# Altium schematic sheet AM625SIP FatBoi.SchDoc (part 1 of 2)
size A0; SheetNumber: 1; SheetTotal: 1
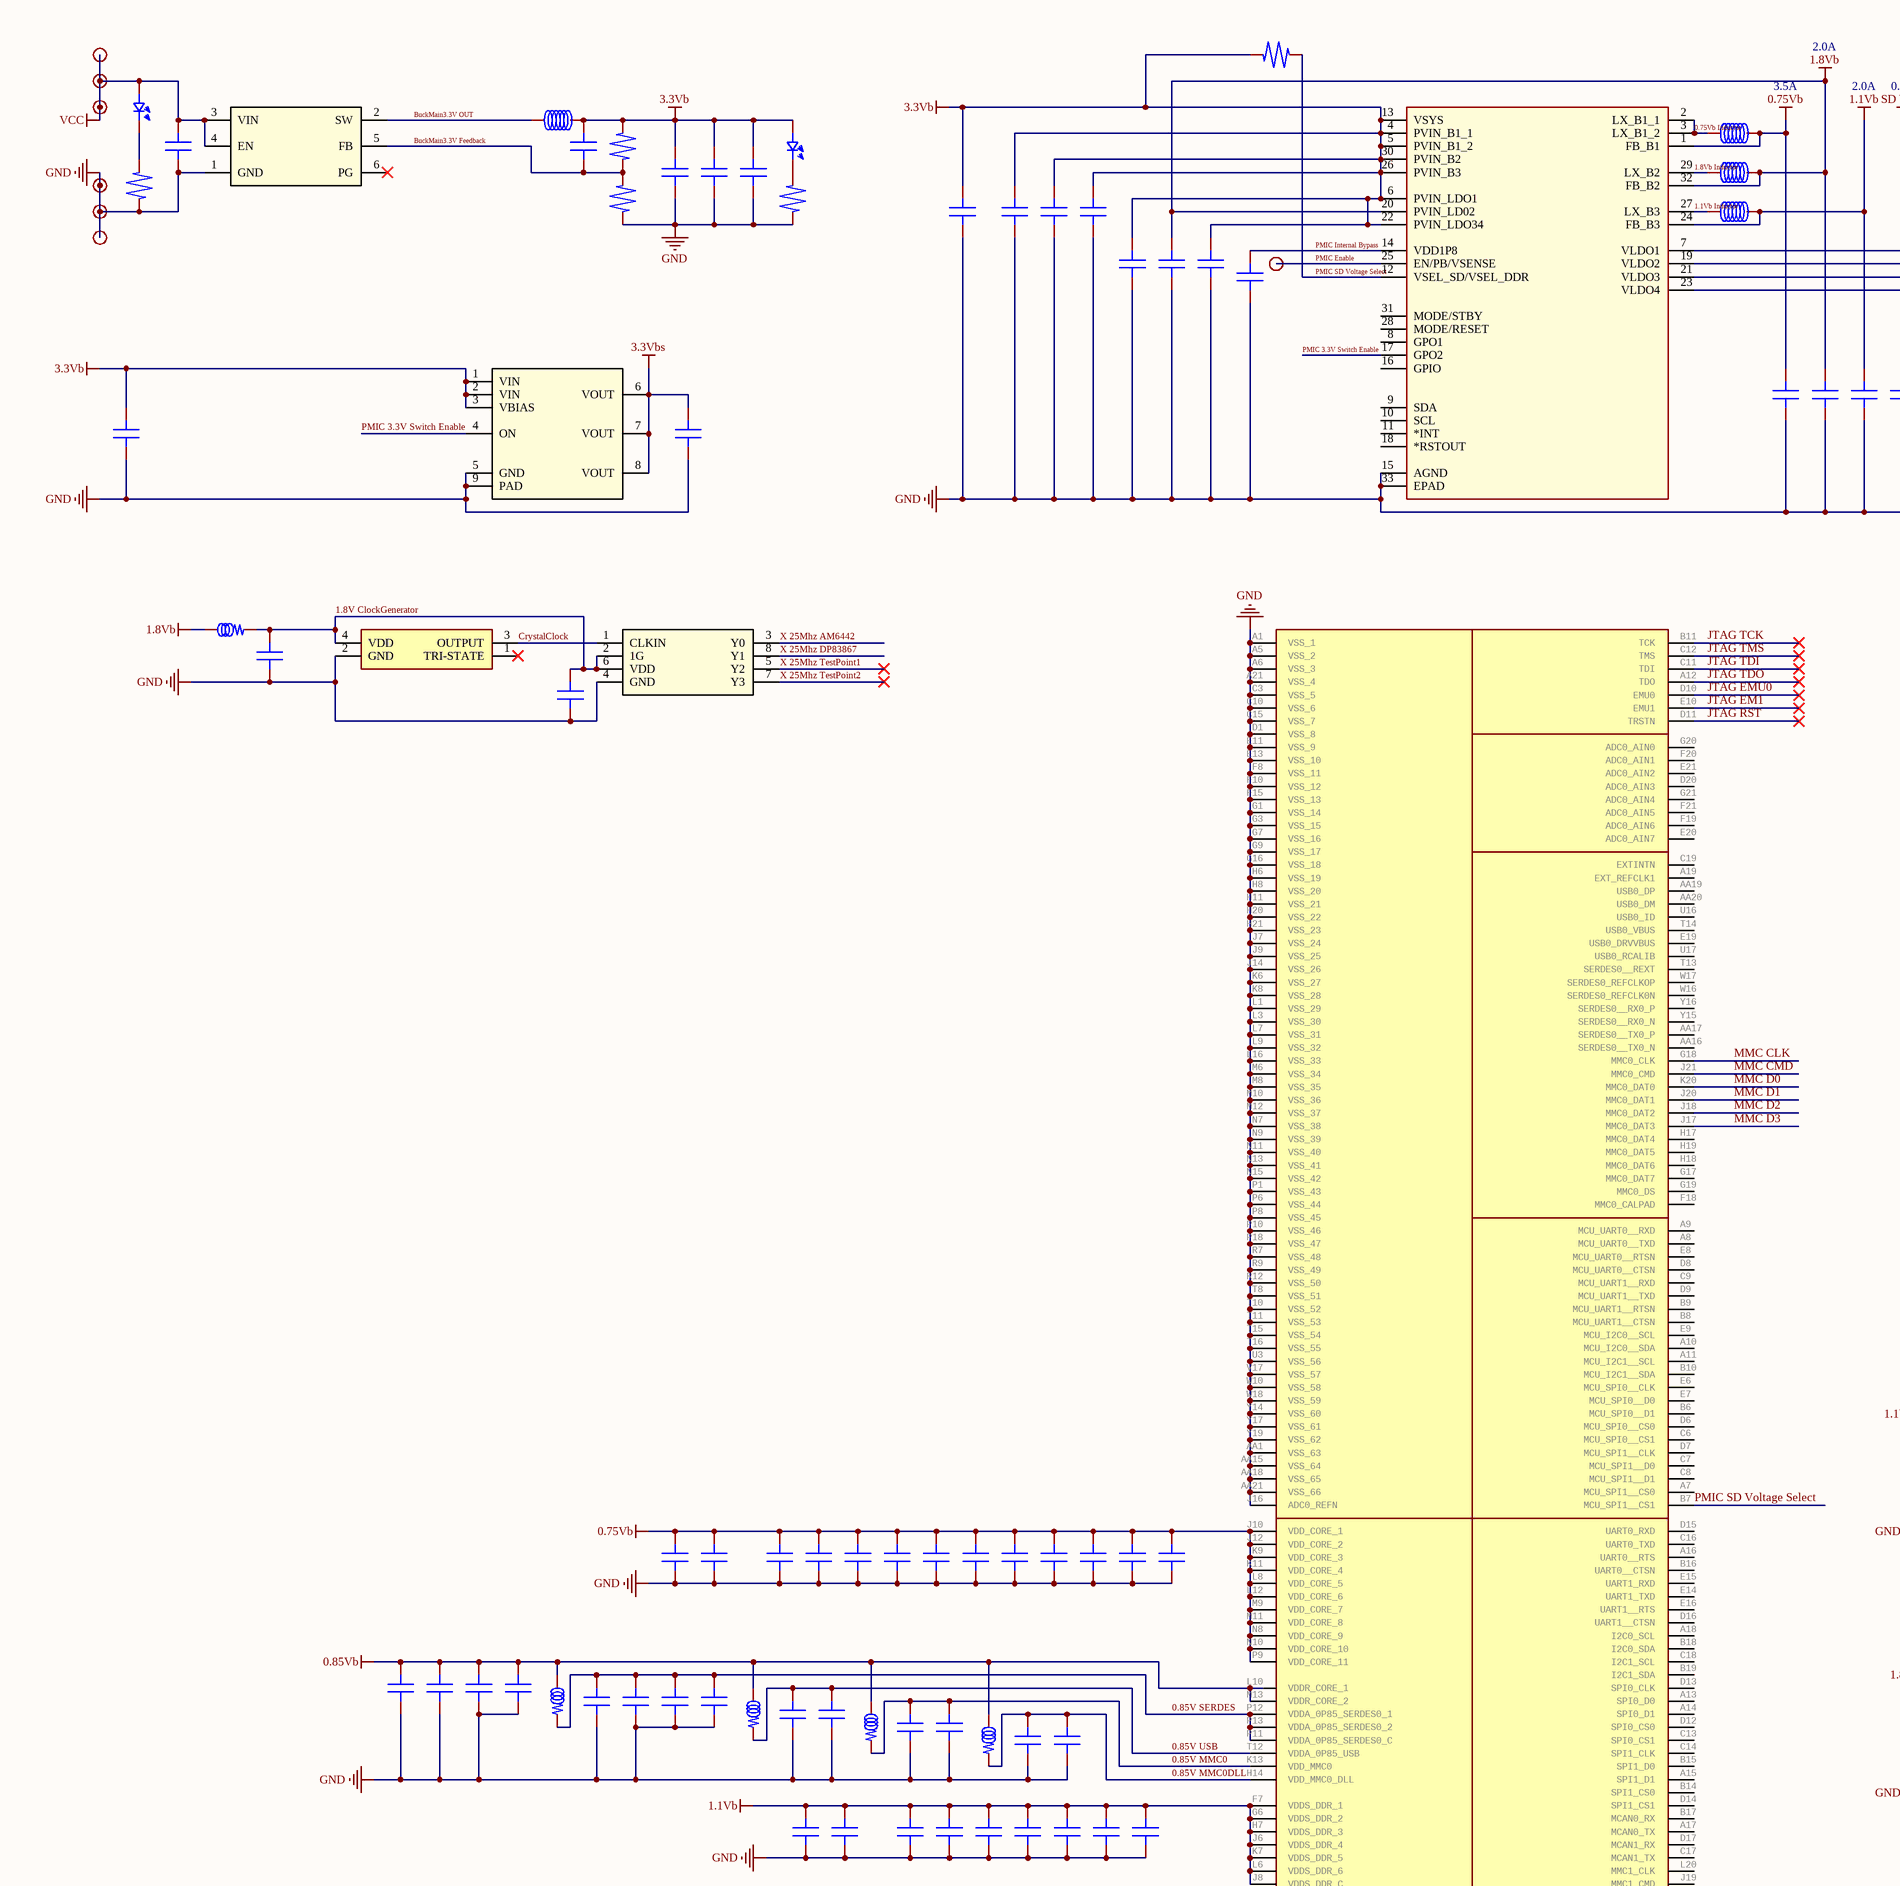
[diagram p0: AM625SIP FatBoi.SchDoc, top left]
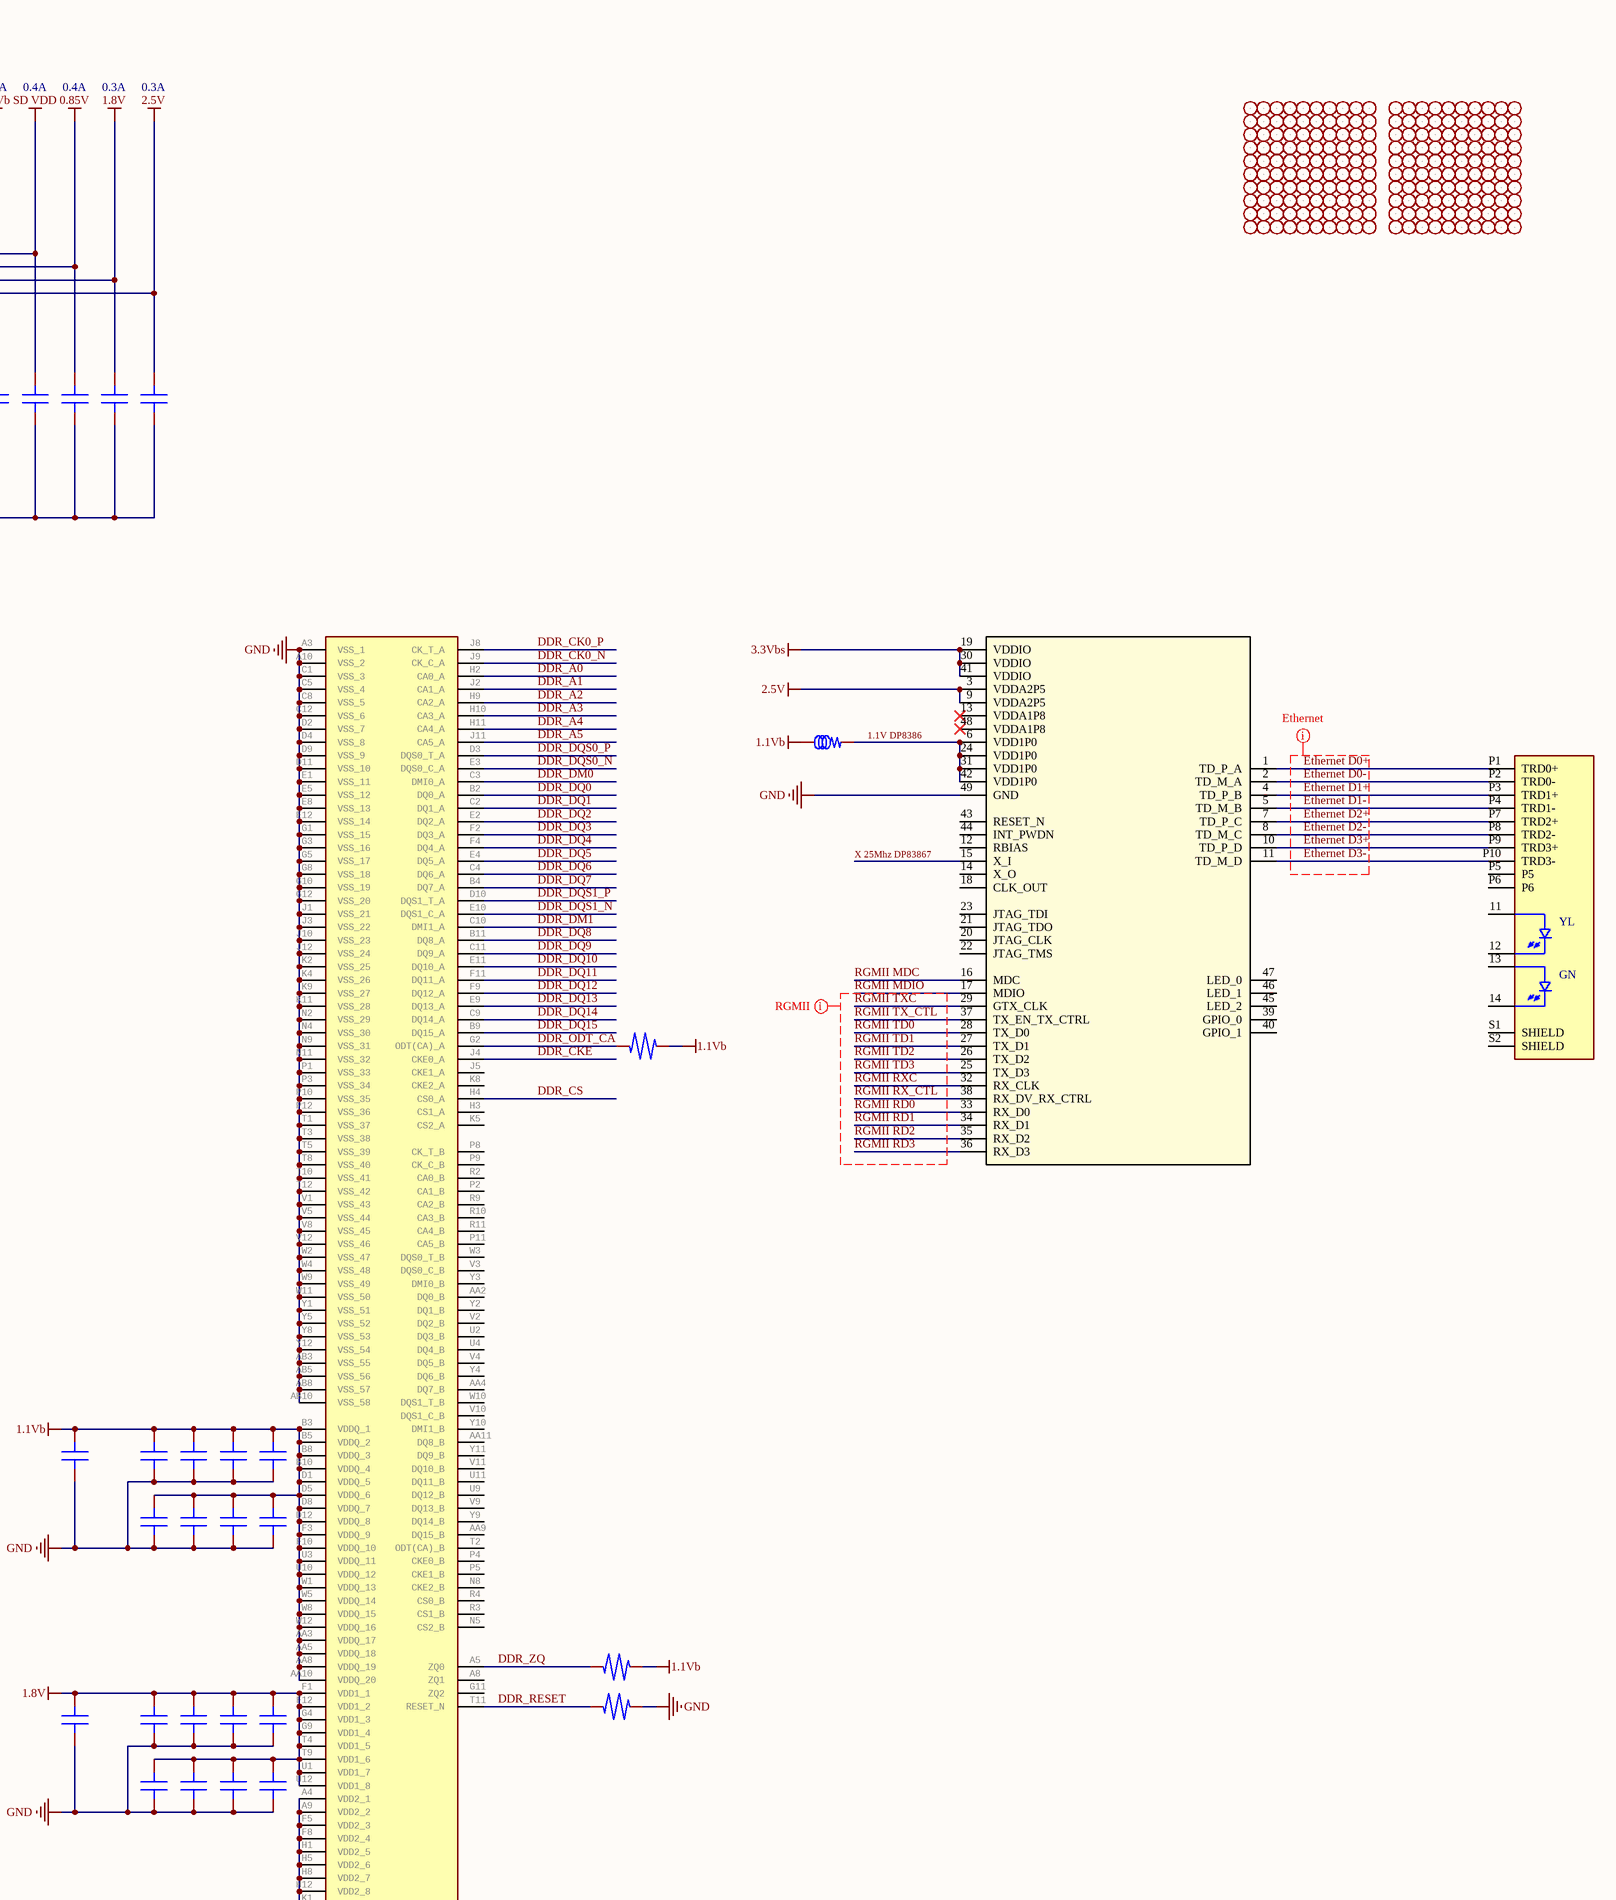
[diagram p1: AM625SIP FatBoi.SchDoc, top middle]
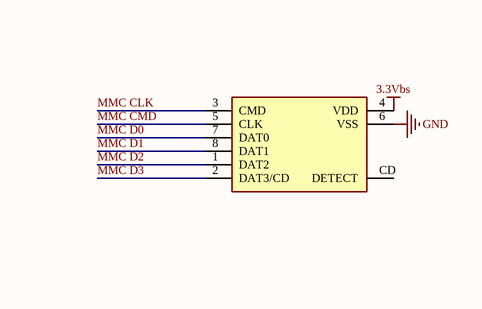
[diagram p2: AM625SIP FatBoi.SchDoc, top right]
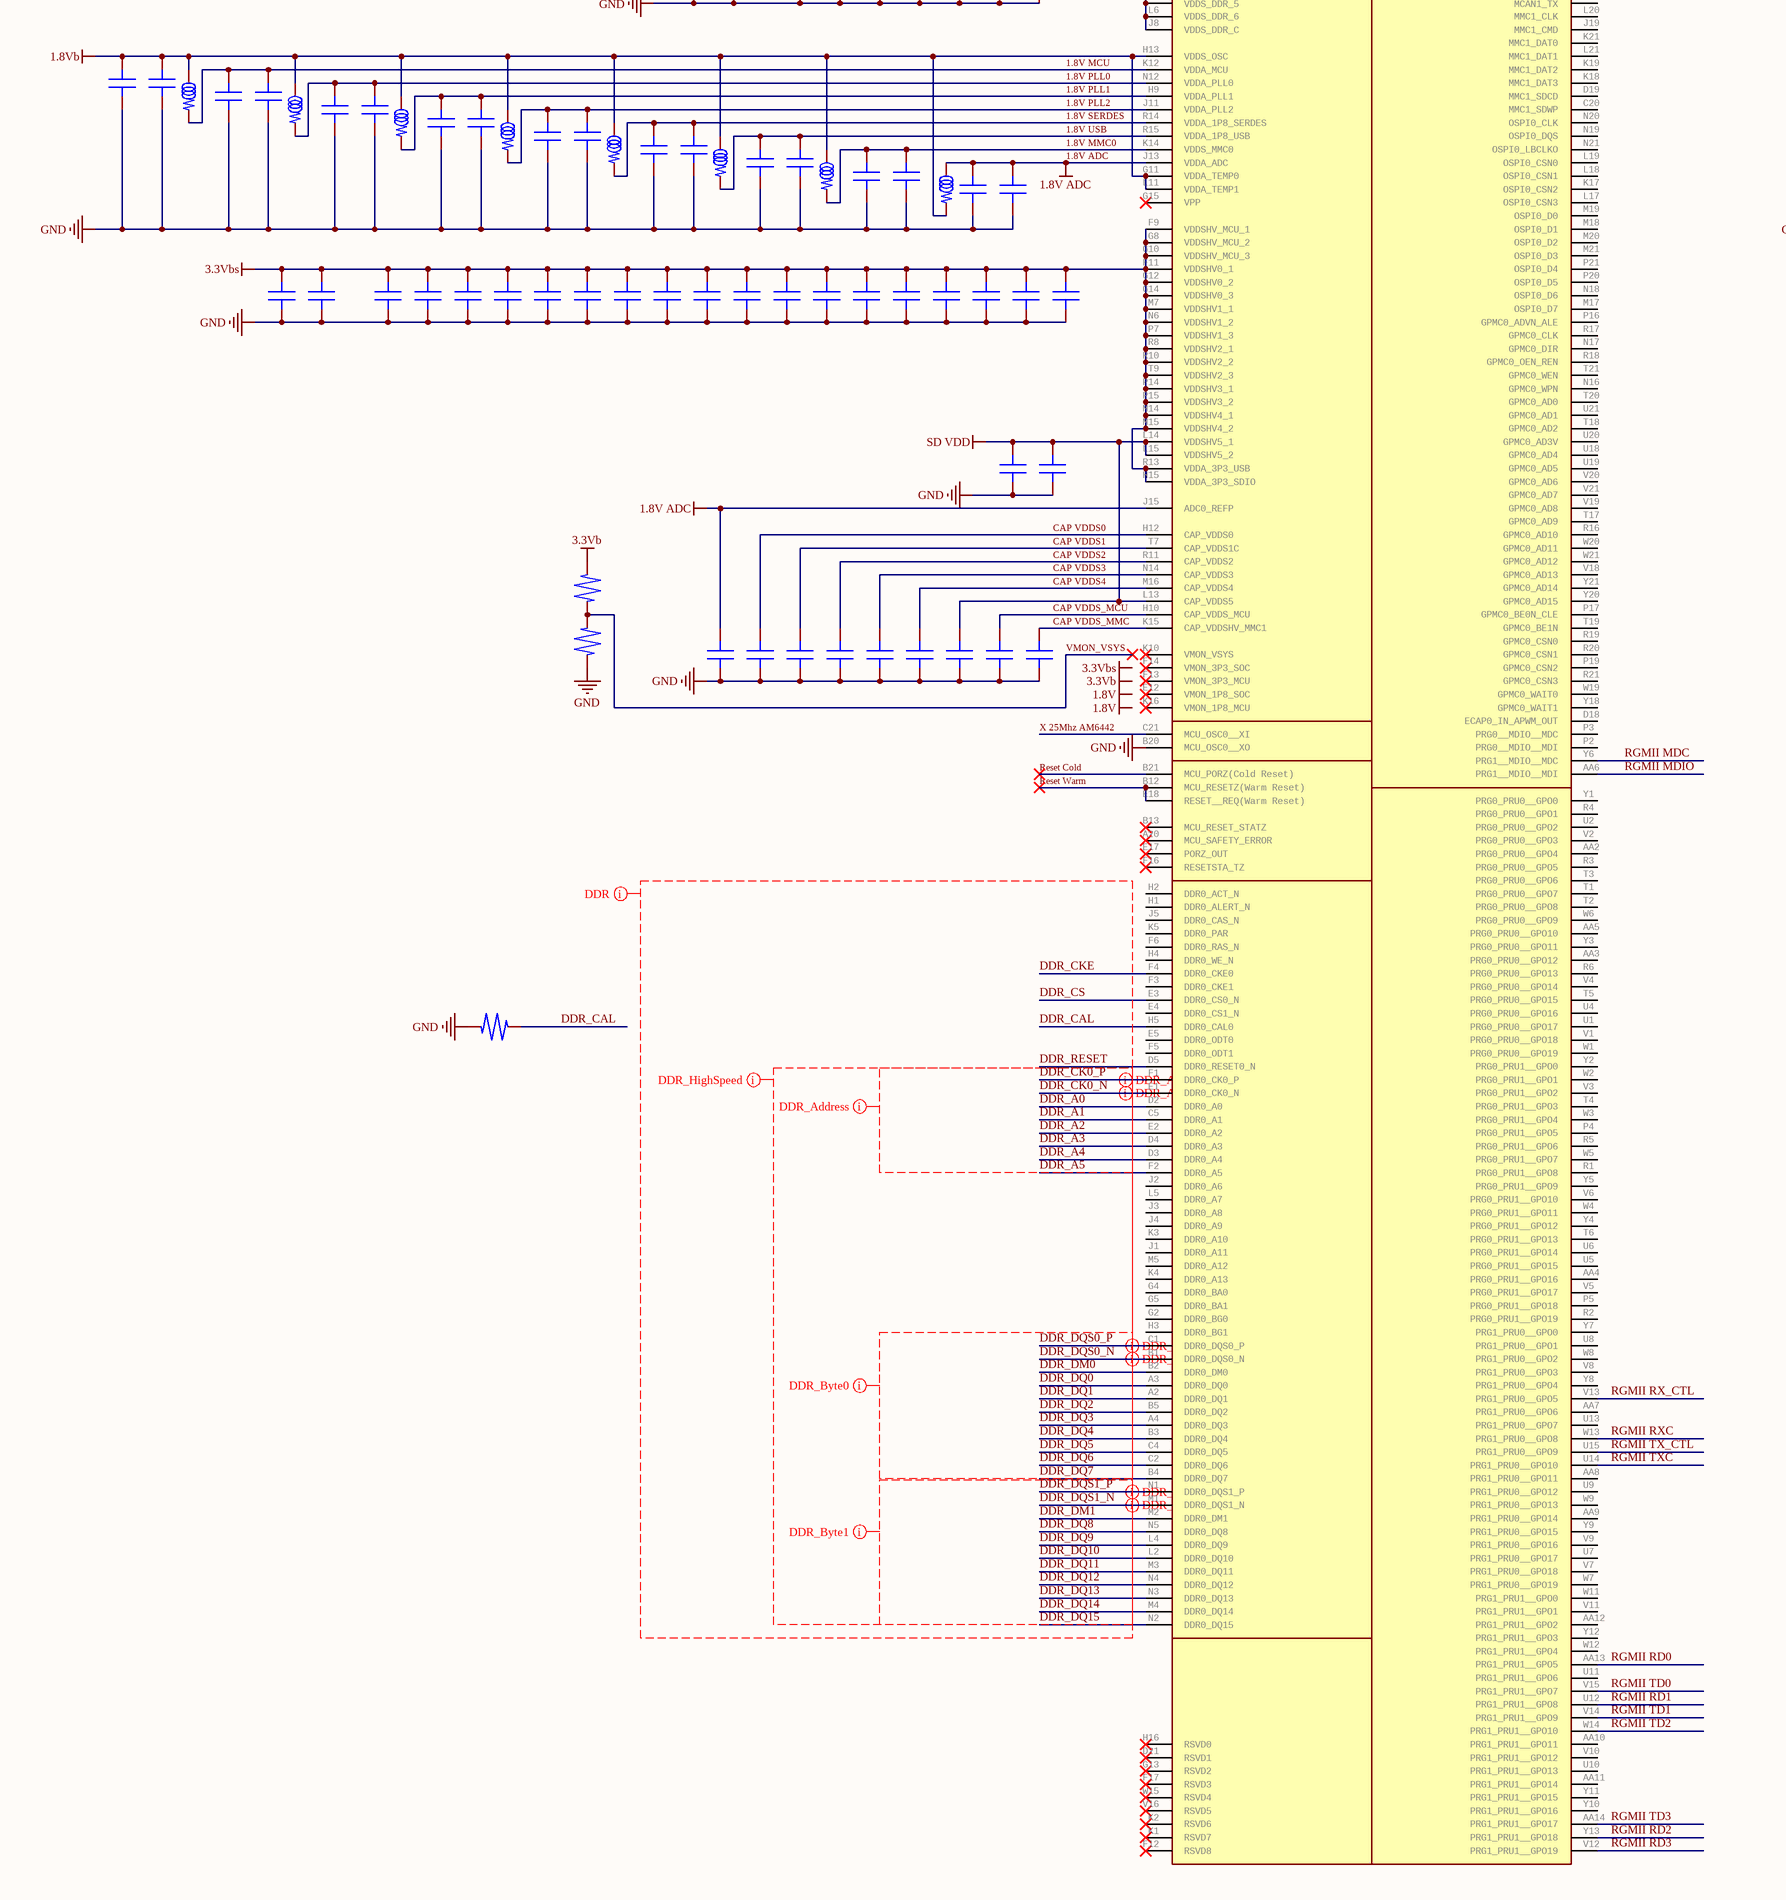
[diagram p3: AM625SIP FatBoi.SchDoc, bottom left]
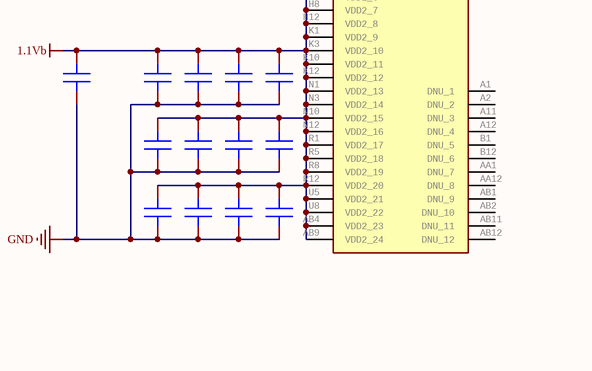
[diagram p4: AM625SIP FatBoi.SchDoc, bottom middle]

## Parts
AM6442  ARM Cortex-A53, ARM Cortex-M5F, ARM Cortex-R5F Microprocessor IC Sitara 7 Core, 64-Bit 1GHz 441-FCBGA (17.2x17.2)   Source:  Datasheet  [AM6442]  (value not drawn)
BergStrip_1  BergStrip  [BergStrip 2.54mm]  (value not drawn)
BergStrip_2  BergStrip  [BergStrip 2.54mm]  (value not drawn)
BergStrip_3  BergStrip  [BergStrip 2.54mm]  (value not drawn)
BergStrip_4  BergStrip  [BergStrip 2.54mm]  (value not drawn)
BergStrip_5  BergStrip  [BergStrip 2.54mm]  (value not drawn)
BergStrip_5V_1  BergStrip  [BergStrip 2.54mm]  (value not drawn)
BergStrip_5V_2  BergStrip  [BergStrip 2.54mm]  (value not drawn)
BergStrip_5V_3  BergStrip  [BergStrip 2.54mm]  (value not drawn)
BergStrip_6  BergStrip  [BergStrip 2.54mm]  (value not drawn)
BergStrip_7  BergStrip  [BergStrip 2.54mm]  (value not drawn)
BergStrip_8  BergStrip  [BergStrip 2.54mm]  (value not drawn)
BergStrip_9  BergStrip  [BergStrip 2.54mm]  (value not drawn)
BergStrip_10  BergStrip  [BergStrip 2.54mm]  (value not drawn)
BergStrip_11  BergStrip  [BergStrip 2.54mm]  (value not drawn)
BergStrip_12  BergStrip  [BergStrip 2.54mm]  (value not drawn)
BergStrip_13  BergStrip  [BergStrip 2.54mm]  (value not drawn)
BergStrip_14  BergStrip  [BergStrip 2.54mm]  (value not drawn)
BergStrip_15  BergStrip  [BergStrip 2.54mm]  (value not drawn)
BergStrip_16  BergStrip  [BergStrip 2.54mm]  (value not drawn)
BergStrip_17  BergStrip  [BergStrip 2.54mm]  (value not drawn)
BergStrip_18  BergStrip  [BergStrip 2.54mm]  (value not drawn)
BergStrip_19  BergStrip  [BergStrip 2.54mm]  (value not drawn)
BergStrip_20  BergStrip  [BergStrip 2.54mm]  (value not drawn)
BergStrip_21  BergStrip  [BergStrip 2.54mm]  (value not drawn)
BergStrip_22  BergStrip  [BergStrip 2.54mm]  (value not drawn)
BergStrip_23  BergStrip  [BergStrip 2.54mm]  (value not drawn)
BergStrip_24  BergStrip  [BergStrip 2.54mm]  (value not drawn)
BergStrip_25  BergStrip  [BergStrip 2.54mm]  (value not drawn)
BergStrip_26  BergStrip  [BergStrip 2.54mm]  (value not drawn)
BergStrip_27  BergStrip  [BergStrip 2.54mm]  (value not drawn)
BergStrip_28  BergStrip  [BergStrip 2.54mm]  (value not drawn)
BergStrip_29  BergStrip  [BergStrip 2.54mm]  (value not drawn)
BergStrip_30  BergStrip  [BergStrip 2.54mm]  (value not drawn)
BergStrip_31  BergStrip  [BergStrip 2.54mm]  (value not drawn)
BergStrip_32  BergStrip  [BergStrip 2.54mm]  (value not drawn)
BergStrip_33  BergStrip  [BergStrip 2.54mm]  (value not drawn)
BergStrip_34  BergStrip  [BergStrip 2.54mm]  (value not drawn)
BergStrip_35  BergStrip  [BergStrip 2.54mm]  (value not drawn)
BergStrip_36  BergStrip  [BergStrip 2.54mm]  (value not drawn)
BergStrip_37  BergStrip  [BergStrip 2.54mm]  (value not drawn)
BergStrip_38  BergStrip  [BergStrip 2.54mm]  (value not drawn)
BergStrip_39  BergStrip  [BergStrip 2.54mm]  (value not drawn)
BergStrip_40  BergStrip  [BergStrip 2.54mm]  (value not drawn)
BergStrip_41  BergStrip  [BergStrip 2.54mm]  (value not drawn)
BergStrip_42  BergStrip  [BergStrip 2.54mm]  (value not drawn)
BergStrip_43  BergStrip  [BergStrip 2.54mm]  (value not drawn)
BergStrip_44  BergStrip  [BergStrip 2.54mm]  (value not drawn)
BergStrip_45  BergStrip  [BergStrip 2.54mm]  (value not drawn)
BergStrip_46  BergStrip  [BergStrip 2.54mm]  (value not drawn)
BergStrip_47  BergStrip  [BergStrip 2.54mm]  (value not drawn)
BergStrip_48  BergStrip  [BergStrip 2.54mm]  (value not drawn)
BergStrip_49  BergStrip  [BergStrip 2.54mm]  (value not drawn)
BergStrip_50  BergStrip  [BergStrip 2.54mm]  (value not drawn)
BergStrip_51  BergStrip  [BergStrip 2.54mm]  (value not drawn)
BergStrip_52  BergStrip  [BergStrip 2.54mm]  (value not drawn)
BergStrip_53  BergStrip  [BergStrip 2.54mm]  (value not drawn)
BergStrip_54  BergStrip  [BergStrip 2.54mm]  (value not drawn)
BergStrip_55  BergStrip  [BergStrip 2.54mm]  (value not drawn)
BergStrip_56  BergStrip  [BergStrip 2.54mm]  (value not drawn)
BergStrip_57  BergStrip  [BergStrip 2.54mm]  (value not drawn)
BergStrip_58  BergStrip  [BergStrip 2.54mm]  (value not drawn)
BergStrip_59  BergStrip  [BergStrip 2.54mm]  (value not drawn)
BergStrip_60  BergStrip  [BergStrip 2.54mm]  (value not drawn)
BergStrip_61  BergStrip  [BergStrip 2.54mm]  (value not drawn)
BergStrip_62  BergStrip  [BergStrip 2.54mm]  (value not drawn)
BergStrip_63  BergStrip  [BergStrip 2.54mm]  (value not drawn)
BergStrip_64  BergStrip  [BergStrip 2.54mm]  (value not drawn)
BergStrip_65  BergStrip  [BergStrip 2.54mm]  (value not drawn)
BergStrip_66  BergStrip  [BergStrip 2.54mm]  (value not drawn)
BergStrip_67  BergStrip  [BergStrip 2.54mm]  (value not drawn)
BergStrip_68  BergStrip  [BergStrip 2.54mm]  (value not drawn)
BergStrip_69  BergStrip  [BergStrip 2.54mm]  (value not drawn)
BergStrip_70  BergStrip  [BergStrip 2.54mm]  (value not drawn)
BergStrip_71  BergStrip  [BergStrip 2.54mm]  (value not drawn)
BergStrip_72  BergStrip  [BergStrip 2.54mm]  (value not drawn)
BergStrip_73  BergStrip  [BergStrip 2.54mm]  (value not drawn)
BergStrip_74  BergStrip  [BergStrip 2.54mm]  (value not drawn)
BergStrip_75  BergStrip  [BergStrip 2.54mm]  (value not drawn)
BergStrip_76  BergStrip  [BergStrip 2.54mm]  (value not drawn)
BergStrip_77  BergStrip  [BergStrip 2.54mm]  (value not drawn)
BergStrip_78  BergStrip  [BergStrip 2.54mm]  (value not drawn)
BergStrip_79  BergStrip  [BergStrip 2.54mm]  (value not drawn)
BergStrip_80  BergStrip  [BergStrip 2.54mm]  (value not drawn)
BergStrip_81  BergStrip  [BergStrip 2.54mm]  (value not drawn)
BergStrip_82  BergStrip  [BergStrip 2.54mm]  (value not drawn)
BergStrip_83  BergStrip  [BergStrip 2.54mm]  (value not drawn)
BergStrip_84  BergStrip  [BergStrip 2.54mm]  (value not drawn)
BergStrip_85  BergStrip  [BergStrip 2.54mm]  (value not drawn)
BergStrip_86  BergStrip  [BergStrip 2.54mm]  (value not drawn)
BergStrip_87  BergStrip  [BergStrip 2.54mm]  (value not drawn)
BergStrip_88  BergStrip  [BergStrip 2.54mm]  (value not drawn)
BergStrip_89  BergStrip  [BergStrip 2.54mm]  (value not drawn)
BergStrip_90  BergStrip  [BergStrip 2.54mm]  (value not drawn)
BergStrip_91  BergStrip  [BergStrip 2.54mm]  (value not drawn)
BergStrip_92  BergStrip  [BergStrip 2.54mm]  (value not drawn)
BergStrip_93  BergStrip  [BergStrip 2.54mm]  (value not drawn)
BergStrip_94  BergStrip  [BergStrip 2.54mm]  (value not drawn)
BergStrip_95  BergStrip  [BergStrip 2.54mm]  (value not drawn)
BergStrip_96  BergStrip  [BergStrip 2.54mm]  (value not drawn)
BergStrip_97  BergStrip  [BergStrip 2.54mm]  (value not drawn)
BergStrip_98  BergStrip  [BergStrip 2.54mm]  (value not drawn)
BergStrip_99  BergStrip  [BergStrip 2.54mm]  (value not drawn)
BergStrip_100  BergStrip  [BergStrip 2.54mm]  (value not drawn)
BergStrip_101  BergStrip  [BergStrip 2.54mm]  (value not drawn)
BergStrip_102  BergStrip  [BergStrip 2.54mm]  (value not drawn)
BergStrip_103  BergStrip  [BergStrip 2.54mm]  (value not drawn)
BergStrip_104  BergStrip  [BergStrip 2.54mm]  (value not drawn)
BergStrip_105  BergStrip  [BergStrip 2.54mm]  (value not drawn)
BergStrip_106  BergStrip  [BergStrip 2.54mm]  (value not drawn)
BergStrip_107  BergStrip  [BergStrip 2.54mm]  (value not drawn)
BergStrip_108  BergStrip  [BergStrip 2.54mm]  (value not drawn)
BergStrip_109  BergStrip  [BergStrip 2.54mm]  (value not drawn)
BergStrip_110  BergStrip  [BergStrip 2.54mm]  (value not drawn)
BergStrip_111  BergStrip  [BergStrip 2.54mm]  (value not drawn)
BergStrip_112  BergStrip  [BergStrip 2.54mm]  (value not drawn)
BergStrip_113  BergStrip  [BergStrip 2.54mm]  (value not drawn)
BergStrip_114  BergStrip  [BergStrip 2.54mm]  (value not drawn)
BergStrip_115  BergStrip  [BergStrip 2.54mm]  (value not drawn)
BergStrip_116  BergStrip  [BergStrip 2.54mm]  (value not drawn)
BergStrip_117  BergStrip  [BergStrip 2.54mm]  (value not drawn)
BergStrip_118  BergStrip  [BergStrip 2.54mm]  (value not drawn)
BergStrip_119  BergStrip  [BergStrip 2.54mm]  (value not drawn)
BergStrip_120  BergStrip  [BergStrip 2.54mm]  (value not drawn)
BergStrip_121  BergStrip  [BergStrip 2.54mm]  (value not drawn)
BergStrip_122  BergStrip  [BergStrip 2.54mm]  (value not drawn)
BergStrip_123  BergStrip  [BergStrip 2.54mm]  (value not drawn)
BergStrip_124  BergStrip  [BergStrip 2.54mm]  (value not drawn)
BergStrip_125  BergStrip  [BergStrip 2.54mm]  (value not drawn)
BergStrip_126  BergStrip  [BergStrip 2.54mm]  (value not drawn)
BergStrip_127  BergStrip  [BergStrip 2.54mm]  (value not drawn)
BergStrip_128  BergStrip  [BergStrip 2.54mm]  (value not drawn)
BergStrip_129  BergStrip  [BergStrip 2.54mm]  (value not drawn)
BergStrip_130  BergStrip  [BergStrip 2.54mm]  (value not drawn)
BergStrip_131  BergStrip  [BergStrip 2.54mm]  (value not drawn)
BergStrip_132  BergStrip  [BergStrip 2.54mm]  (value not drawn)
BergStrip_133  BergStrip  [BergStrip 2.54mm]  (value not drawn)
BergStrip_134  BergStrip  [BergStrip 2.54mm]  (value not drawn)
BergStrip_135  BergStrip  [BergStrip 2.54mm]  (value not drawn)
BergStrip_136  BergStrip  [BergStrip 2.54mm]  (value not drawn)
BergStrip_137  BergStrip  [BergStrip 2.54mm]  (value not drawn)
BergStrip_138  BergStrip  [BergStrip 2.54mm]  (value not drawn)
BergStrip_139  BergStrip  [BergStrip 2.54mm]  (value not drawn)
BergStrip_140  BergStrip  [BergStrip 2.54mm]  (value not drawn)
BergStrip_141  BergStrip  [BergStrip 2.54mm]  (value not drawn)
BergStrip_142  BergStrip  [BergStrip 2.54mm]  (value not drawn)
BergStrip_143  BergStrip  [BergStrip 2.54mm]  (value not drawn)
BergStrip_144  BergStrip  [BergStrip 2.54mm]  (value not drawn)
BergStrip_145  BergStrip  [BergStrip 2.54mm]  (value not drawn)
BergStrip_146  BergStrip  [BergStrip 2.54mm]  (value not drawn)
BergStrip_147  BergStrip  [BergStrip 2.54mm]  (value not drawn)
BergStrip_148  BergStrip  [BergStrip 2.54mm]  (value not drawn)
BergStrip_149  BergStrip  [BergStrip 2.54mm]  (value not drawn)
BergStrip_150  BergStrip  [BergStrip 2.54mm]  (value not drawn)
BergStrip_151  BergStrip  [BergStrip 2.54mm]  (value not drawn)
BergStrip_152  BergStrip  [BergStrip 2.54mm]  (value not drawn)
BergStrip_153  BergStrip  [BergStrip 2.54mm]  (value not drawn)
BergStrip_154  BergStrip  [BergStrip 2.54mm]  (value not drawn)
BergStrip_155  BergStrip  [BergStrip 2.54mm]  (value not drawn)
BergStrip_156  BergStrip  [BergStrip 2.54mm]  (value not drawn)
BergStrip_157  BergStrip  [BergStrip 2.54mm]  (value not drawn)
BergStrip_158  BergStrip  [BergStrip 2.54mm]  (value not drawn)
BergStrip_159  BergStrip  [BergStrip 2.54mm]  (value not drawn)
BergStrip_160  BergStrip  [BergStrip 2.54mm]  (value not drawn)
BergStrip_161  BergStrip  [BergStrip 2.54mm]  (value not drawn)
BergStrip_162  BergStrip  [BergStrip 2.54mm]  (value not drawn)
BergStrip_163  BergStrip  [BergStrip 2.54mm]  (value not drawn)
BergStrip_164  BergStrip  [BergStrip 2.54mm]  (value not drawn)
BergStrip_165  BergStrip  [BergStrip 2.54mm]  (value not drawn)
BergStrip_166  BergStrip  [BergStrip 2.54mm]  (value not drawn)
BergStrip_167  BergStrip  [BergStrip 2.54mm]  (value not drawn)
BergStrip_168  BergStrip  [BergStrip 2.54mm]  (value not drawn)
BergStrip_169  BergStrip  [BergStrip 2.54mm]  (value not drawn)
BergStrip_170  BergStrip  [BergStrip 2.54mm]  (value not drawn)
BergStrip_171  BergStrip  [BergStrip 2.54mm]  (value not drawn)
BergStrip_172  BergStrip  [BergStrip 2.54mm]  (value not drawn)
BergStrip_173  BergStrip  [BergStrip 2.54mm]  (value not drawn)
BergStrip_174  BergStrip  [BergStrip 2.54mm]  (value not drawn)
BergStrip_175  BergStrip  [BergStrip 2.54mm]  (value not drawn)
BergStrip_176  BergStrip  [BergStrip 2.54mm]  (value not drawn)
BergStrip_177  BergStrip  [BergStrip 2.54mm]  (value not drawn)
BergStrip_178  BergStrip  [BergStrip 2.54mm]  (value not drawn)
BergStrip_179  BergStrip  [BergStrip 2.54mm]  (value not drawn)
BergStrip_180  BergStrip  [BergStrip 2.54mm]  (value not drawn)
BergStrip_181  BergStrip  [BergStrip 2.54mm]  (value not drawn)
BergStrip_182  BergStrip  [BergStrip 2.54mm]  (value not drawn)
BergStrip_183  BergStrip  [BergStrip 2.54mm]  (value not drawn)
BergStrip_184  BergStrip  [BergStrip 2.54mm]  (value not drawn)
BergStrip_185  BergStrip  [BergStrip 2.54mm]  (value not drawn)
BergStrip_186  BergStrip  [BergStrip 2.54mm]  (value not drawn)
BergStrip_187  BergStrip  [BergStrip 2.54mm]  (value not drawn)
BergStrip_188  BergStrip  [BergStrip 2.54mm]  (value not drawn)
BergStrip_189  BergStrip  [BergStrip 2.54mm]  (value not drawn)
BergStrip_190  BergStrip  [BergStrip 2.54mm]  (value not drawn)
BergStrip_191  BergStrip  [BergStrip 2.54mm]  (value not drawn)
BergStrip_192  BergStrip  [BergStrip 2.54mm]  (value not drawn)
BergStrip_193  BergStrip  [BergStrip 2.54mm]  (value not drawn)
BergStrip_194  BergStrip  [BergStrip 2.54mm]  (value not drawn)
BergStrip_195  BergStrip  [BergStrip 2.54mm]  (value not drawn)
BergStrip_196  BergStrip  [BergStrip 2.54mm]  (value not drawn)
BergStrip_197  BergStrip  [BergStrip 2.54mm]  (value not drawn)
BergStrip_198  BergStrip  [BergStrip 2.54mm]  (value not drawn)
BergStrip_199  BergStrip  [BergStrip 2.54mm]  (value not drawn)
BergStrip_200  BergStrip  [BergStrip 2.54mm]  (value not drawn)
BergStrip_GND_1  BergStrip  [BergStrip 2.54mm]  (value not drawn)
BergStrip_GND_2  BergStrip  [BergStrip 2.54mm]  (value not drawn)
BergStrip_GND_3  BergStrip  [BergStrip 2.54mm]  (value not drawn)
BergStrip_PMICEnable  BergStrip  [BergStrip 2.54mm]  (value not drawn)
BuckMain  Buck TPS62A06DRLR  [Buck TPS62A06DRLR]  (value not drawn)
C_0.75V_1uF  1uF  [Capacitor 2012(0805)]  (value not drawn)
C_0.75V_47uF  47uF  [Capacitor 2012(0805)]  (value not drawn)
C_0.75V_Core1  0.1uF  [Capacitor 1005(0402)]  (value not drawn)
C_0.75V_Core2  0.1uF  [Capacitor 1005(0402)]  (value not drawn)
C_0.75V_Core3  0.1uF  [Capacitor 1005(0402)]  (value not drawn)
C_0.75V_Core4  0.1uF  [Capacitor 1005(0402)]  (value not drawn)
C_0.75V_Core5  0.1uF  [Capacitor 1005(0402)]  (value not drawn)
C_0.75V_Core6  0.1uF  [Capacitor 1005(0402)]  (value not drawn)
C_0.75V_Core7  0.1uF  [Capacitor 1005(0402)]  (value not drawn)
C_0.75V_Core8  0.1uF  [Capacitor 1005(0402)]  (value not drawn)
C_0.75V_Core9  0.1uF  [Capacitor 1005(0402)]  (value not drawn)
C_0.75V_Core10  0.1uF  [Capacitor 1005(0402)]  (value not drawn)
C_0.75V_Core11  0.1uF  [Capacitor 1005(0402)]  (value not drawn)
C_0.85V_1uF  1uF  [Capacitor 2012(0805)]  (value not drawn)
C_0.85V_4.7uF  4.7uF  [Capacitor 2012(0805)]  (value not drawn)
C_0.85V_Core1  0.1uF  [Capacitor 1005(0402)]  (value not drawn)
C_0.85V_Core2  0.1uF  [Capacitor 1005(0402)]  (value not drawn)
C_0.85V_MMC0  0.01uF  [Capacitor 1005(0402)]  (value not drawn)
C_0.85V_MMC0_0.1uF  0.1uF  [Capacitor 2012(0805)]  (value not drawn)
C_0.85V_MMC0DLL  0.01uF  [Capacitor 1005(0402)]  (value not drawn)
C_0.85V_MMC0DLL_0.1uF  0.1uF  [Capacitor 2012(0805)]  (value not drawn)
C_0.85V_SERDES1  0.01uF  [Capacitor 1005(0402)]  (value not drawn)
C_0.85V_SERDES2  0.01uF  [Capacitor 1005(0402)]  (value not drawn)
C_0.85V_SERDES3  0.01uF  [Capacitor 1005(0402)]  (value not drawn)
C_0.85V_SERDES_0.1uF  0.1uF  [Capacitor 2012(0805)]  (value not drawn)
C_0.85V_USB  0.1uF  [Capacitor 1005(0402)]  (value not drawn)
C_0.85V_USB_1uF  1uF  [Capacitor 2012(0805)]  (value not drawn)
C_1.1V_DDR1  0.1uF  [Capacitor 1005(0402)]  (value not drawn)
C_1.1V_DDR2  0.1uF  [Capacitor 1005(0402)]  (value not drawn)
C_1.1V_DDR3  0.1uF  [Capacitor 1005(0402)]  (value not drawn)
C_1.1V_DDR4  0.1uF  [Capacitor 1005(0402)]  (value not drawn)
C_1.1V_DDR5  0.1uF  [Capacitor 1005(0402)]  (value not drawn)
C_1.1V_DDR6  0.1uF  [Capacitor 1005(0402)]  (value not drawn)
C_1.1V_DDR7  0.1uF  [Capacitor 1005(0402)]  (value not drawn)
C_1.1V_DDR8  0.1uF  [Capacitor 1005(0402)]  (value not drawn)
C_1.1V_DDR9  0.1uF  [Capacitor 1005(0402)]  (value not drawn)
C_1.1V_DDR10  0.1uF  [Capacitor 1005(0402)]  (value not drawn)
C_1.1V_DDR11  0.1uF  [Capacitor 1005(0402)]  (value not drawn)
C_1.1V_DDR12  0.1uF  [Capacitor 1005(0402)]  (value not drawn)
C_1.1V_DDR13  0.1uF  [Capacitor 1005(0402)]  (value not drawn)
C_1.1V_DDR14  0.1uF  [Capacitor 1005(0402)]  (value not drawn)
C_1.1V_DDR15  0.1uF  [Capacitor 1005(0402)]  (value not drawn)
C_1.1V_DDR16  0.1uF  [Capacitor 1005(0402)]  (value not drawn)
C_1.1V_DDR17  0.1uF  [Capacitor 1005(0402)]  (value not drawn)
C_1.1V_DDR18  0.1uF  [Capacitor 1005(0402)]  (value not drawn)
C_1.1V_DDR19  0.1uF  [Capacitor 1005(0402)]  (value not drawn)
C_1.1V_DDR20  0.1uF  [Capacitor 1005(0402)]  (value not drawn)
C_1.1V_DDR21  0.1uF  [Capacitor 1005(0402)]  (value not drawn)
C_1.1V_DDR22  0.1uF  [Capacitor 1005(0402)]  (value not drawn)
C_1.1V_DDR23  0.1uF  [Capacitor 1005(0402)]  (value not drawn)
C_1.1V_DDR24  0.1uF  [Capacitor 1005(0402)]  (value not drawn)
C_1.1V_DDR25  0.1uF  [Capacitor 1005(0402)]  (value not drawn)
C_1.1V_DDR26  0.1uF  [Capacitor 1005(0402)]  (value not drawn)
C_1.1V_DDR27  0.1uF  [Capacitor 1005(0402)]  (value not drawn)
C_1.1V_DDR_1uF  1uF  [Capacitor 2012(0805)]  (value not drawn)
C_1.1V_DDR_10uF  10uF  [Capacitor 2012(0805)]  (value not drawn)
C_1.1V_DDR_VDD2_10uF  10uF  [Capacitor 2012(0805)]  (value not drawn)
C_1.1V_DDR_VDDQ_10uF  10uF  [Capacitor 2012(0805)]  (value not drawn)
C_1.8V_ADC  0.1uF  [Capacitor 1005(0402)]  (value not drawn)
C_1.8V_ADC_1uF  1uF  [Capacitor 2012(0805)]  (value not drawn)
C_1.8V_ADCREF  1uF  [Capacitor 1005(0402)]  (value not drawn)
C_1.8V_ClockBuffer  1uF  [Capacitor 2012(0805)]  (value not drawn)
C_1.8V_Crystal  1uF  [Capacitor 2012(0805)]  (value not drawn)
C_1.8V_DDR1  0.1uF  [Capacitor 1005(0402)]  (value not drawn)
C_1.8V_DDR2  0.1uF  [Capacitor 1005(0402)]  (value not drawn)
C_1.8V_DDR3  0.1uF  [Capacitor 1005(0402)]  (value not drawn)
C_1.8V_DDR4  0.1uF  [Capacitor 1005(0402)]  (value not drawn)
C_1.8V_DDR5  0.1uF  [Capacitor 1005(0402)]  (value not drawn)
C_1.8V_DDR6  0.1uF  [Capacitor 1005(0402)]  (value not drawn)
C_1.8V_DDR7  0.1uF  [Capacitor 1005(0402)]  (value not drawn)
C_1.8V_DDR8  0.1uF  [Capacitor 1005(0402)]  (value not drawn)
C_1.8V_DDR_VDD1_10uF  10uF  [Capacitor 2012(0805)]  (value not drawn)
C_1.8V_MCU  0.1uF  [Capacitor 1005(0402)]  (value not drawn)
C_1.8V_MCU_1uF  1uF  [Capacitor 2012(0805)]  (value not drawn)
C_1.8V_MMC0  0.1uF  [Capacitor 1005(0402)]  (value not drawn)
C_1.8V_MMC0_1uF  1uF  [Capacitor 2012(0805)]  (value not drawn)
C_1.8V_OSC  0.1uF  [Capacitor 1005(0402)]  (value not drawn)
C_1.8V_OSC_1uF  1uF  [Capacitor 2012(0805)]  (value not drawn)
C_1.8V_PLL0  0.1uF  [Capacitor 1005(0402)]  (value not drawn)
C_1.8V_PLL0_1uF  1uF  [Capacitor 2012(0805)]  (value not drawn)
C_1.8V_PLL1  0.1uF  [Capacitor 1005(0402)]  (value not drawn)
C_1.8V_PLL1_1uF  1uF  [Capacitor 2012(0805)]  (value not drawn)
C_1.8V_PLL2  0.1uF  [Capacitor 1005(0402)]  (value not drawn)
C_1.8V_PLL2_1uF  1uF  [Capacitor 2012(0805)]  (value not drawn)
C_1.8V_SERDES  0.1uF  [Capacitor 1005(0402)]  (value not drawn)
C_1.8V_SERDES_1uF  1uF  [Capacitor 2012(0805)]  (value not drawn)
C_1.8V_USB  0.1uF  [Capacitor 1005(0402)]  (value not drawn)
C_1.8V_USB_1uF  1uF  [Capacitor 2012(0805)]  (value not drawn)
C_3.3V_1uF  1uF  [Capacitor 2012(0805)]  (value not drawn)
C_3.3V_4.7uF  4.7uF  [Capacitor 2012(0805)]  (value not drawn)
C_3.3V_MCU1  0.1uF  [Capacitor 1005(0402)]  (value not drawn)
C_3.3V_MCU2  0.1uF  [Capacitor 1005(0402)]  (value not drawn)
C_3.3V_MCU3  0.1uF  [Capacitor 1005(0402)]  (value not drawn)
C_3.3V_SDIO  0.1uF  [Capacitor 1005(0402)]  (value not drawn)
C_3.3V_SHV01  0.1uF  [Capacitor 1005(0402)]  (value not drawn)
C_3.3V_SHV02  0.1uF  [Capacitor 1005(0402)]  (value not drawn)
C_3.3V_SHV03  0.1uF  [Capacitor 1005(0402)]  (value not drawn)
C_3.3V_SHV11  0.1uF  [Capacitor 1005(0402)]  (value not drawn)
C_3.3V_SHV12  0.1uF  [Capacitor 1005(0402)]  (value not drawn)
C_3.3V_SHV13  0.1uF  [Capacitor 1005(0402)]  (value not drawn)
C_3.3V_SHV21  0.1uF  [Capacitor 1005(0402)]  (value not drawn)
C_3.3V_SHV22  0.1uF  [Capacitor 1005(0402)]  (value not drawn)
C_3.3V_SHV23  0.1uF  [Capacitor 1005(0402)]  (value not drawn)
C_3.3V_SHV31  0.1uF  [Capacitor 1005(0402)]  (value not drawn)
C_3.3V_SHV32  0.1uF  [Capacitor 1005(0402)]  (value not drawn)
C_3.3V_SHV41  0.1uF  [Capacitor 1005(0402)]  (value not drawn)
C_3.3V_SHV42  0.1uF  [Capacitor 1005(0402)]  (value not drawn)
C_3.3V_SHV51  0.1uF  [Capacitor 1005(0402)]  (value not drawn)
C_3.3V_SHV52  0.1uF  [Capacitor 1005(0402)]  (value not drawn)
C_3.3V_USB  0.1uF  [Capacitor 1005(0402)]  (value not drawn)
C_AM6442_CAP_VDDS0  1uF  [Capacitor 1005(0402)]  (value not drawn)
C_AM6442_CAP_VDDS1  1uF  [Capacitor 1005(0402)]  (value not drawn)
C_AM6442_CAP_VDDS2  1uF  [Capacitor 1005(0402)]  (value not drawn)
C_AM6442_CAP_VDDS3  1uF  [Capacitor 1005(0402)]  (value not drawn)
C_AM6442_CAP_VDDS4  1uF  [Capacitor 1005(0402)]  (value not drawn)
C_AM6442_CAP_VDDS5  1uF  [Capacitor 1005(0402)]  (value not drawn)
C_AM6442_CAP_VDDS_MCU  1uF  [Capacitor 1005(0402)]  (value not drawn)
C_AM6442_CAP_VDDS_MMC  1uF  [Capacitor 1005(0402)]  (value not drawn)
C_BuckMain_Feedback  120pF  [Capacitor 2012(0805)]  (value not drawn)
C_BuckMain_VIN  22uF  [Capacitor 2012(0805)]  (value not drawn)
C_BuckMain_VOUT1  22uF  [Capacitor 2012(0805)]  (value not drawn)
C_BuckMain_VOUT2  22uF  [Capacitor 2012(0805)]  (value not drawn)
C_BuckMain_VOUT3  22uF  [Capacitor 2012(0805)]  (value not drawn)
C_PMIC_0.75V  47uF  [Capacitor 2012(0805)]  (value not drawn)
C_PMIC_0.85V  2.2uF  [Capacitor 2012(0805)]  (value not drawn)
C_PMIC_1.1V  47uF  [Capacitor 2012(0805)]  (value not drawn)
C_PMIC_1.8V  47uF  [Capacitor 2012(0805)]  (value not drawn)
C_PMIC_1.8V*  2.2uF  [Capacitor 2012(0805)]  (value not drawn)
C_PMIC_2.5V  2.2uF  [Capacitor 2012(0805)]  (value not drawn)
C_PMIC_InternalBypass  2.2uF  [Capacitor 2012(0805)]  (value not drawn)
C_PMIC_SD_VDD  2.2uF  [Capacitor 2012(0805)]  (value not drawn)
C_PMIC_VIN_B1  4.7uF  [Capacitor 2012(0805)]  (value not drawn)
C_PMIC_VIN_B2  4.7uF  [Capacitor 2012(0805)]  (value not drawn)
C_PMIC_VIN_B3  4.7uF  [Capacitor 2012(0805)]  (value not drawn)
C_PMIC_VIN_LDO1  2.2uF  [Capacitor 2012(0805)]  (value not drawn)
C_PMIC_VIN_LDO2  2.2uF  [Capacitor 2012(0805)]  (value not drawn)
C_PMIC_VIN_LDO34  4.7uF  [Capacitor 2012(0805)]  (value not drawn)
C_PMIC_VSYS  4.7uF  [Capacitor 2012(0805)]  (value not drawn)
C_Switch3.3V_VIN  10uF  [Capacitor 2012(0805)]  (value not drawn)
C_Switch3.3V_VOUT  1uF  [Capacitor 2012(0805)]  (value not drawn)
ClockBuffer  Clock Buffer  [ClockBuffer LMK1C1104]  (value not drawn)
CONSD  DM3AT-SF-PEJM5_40_  [MicroSD Connector MEM2085]  (value not drawn)
DP83867IRRGZR  DP83867IRRGZR  [DP83867IRRGZR]  (value not drawn)
F_0.85V_MMC0  Ferrite  [Ferrite 2012(0805)]  (value not drawn)
F_0.85V_MMC0DLL  Ferrite  [Ferrite 2012(0805)]  (value not drawn)
F_0.85V_SERDES  Ferrite  [Ferrite 2012(0805)]  (value not drawn)
F_0.85V_USB  Ferrite  [Ferrite 2012(0805)]  (value not drawn)
F_1.1VV_DP8386  Ferrite  [Ferrite 2012(0805)]  (value not drawn)
F_1.8V_ADC  Ferrite  [Ferrite 2012(0805)]  (value not drawn)
F_1.8V_Crystal  Ferrite  [Ferrite 2012(0805)]  (value not drawn)
F_1.8V_MCU  Ferrite  [Ferrite 2012(0805)]  (value not drawn)
F_1.8V_MMC0  Ferrite  [Ferrite 2012(0805)]  (value not drawn)
F_1.8V_PLL0  Ferrite  [Ferrite 2012(0805)]  (value not drawn)
F_1.8V_PLL1  Ferrite  [Ferrite 2012(0805)]  (value not drawn)
F_1.8V_PLL2  Ferrite  [Ferrite 2012(0805)]  (value not drawn)
F_1.8V_SERDES  Ferrite  [Ferrite 2012(0805)]  (value not drawn)
F_1.8V_USB  Ferrite  [Ferrite 2012(0805)]  (value not drawn)
L_BuckMain  0.22uH  [Inductor 5.2x5.2]  (value not drawn)
L_PMIC_Buck1  0.47uH  [Inductor 2016(0806)]  (value not drawn)
L_PMIC_Buck2  0.47uH  [Inductor 2016(0806)]  (value not drawn)
L_PMIC_Buck3  0.47uH  [Inductor 2016(0806)]  (value not drawn)
LED_3.3Vb  Ferrite  [LED 2012(0805)]  (value not drawn)
LED_VCC  Ferrite  [LED 2012(0805)]  (value not drawn)
LPDDR4  Die Density: 16Gbits  Organization  x 16 bits: 128M words x 16 bits x 8 banks  2 pieces of 16Gb (x16) in one package (For 32Gb case)  Row Address: R0 ~ R16  Column Address: C0 ~ C9  Package  200-ball FBGA  Power supply  VDD1 = 1.8V (1.70V to 1.95V) ,  VDD2, VDDCA and VDDQ = 1.1V (1.06V to 1.17V)  Data rate:  3733Mbps max. Backward compatible  Eight internal banks per channel for concurrent operation  Burst lengths (BL): 16, 32 and on-the-fly - On the fly mode is enabled by   Source:  Datasheet  [LPDDR4]  (value not drawn)
MagJack0  MagJack 8P9C  [MagJack 8P9C]  (value not drawn)
PMIC  PMIC TPS6522053  [PMIC TPS6522053]  (value not drawn)
R_3.3Vb_LED  Resistor  [Resistor 2012(0805)]  (value not drawn)
R_BuckMain_Divider1  Resistor  [Resistor 2012(0805)]  (value not drawn)
R_BuckMain_Divider3  Resistor  [Resistor 2012(0805)]  (value not drawn)
R_DDR_CAL  Resistor  [Resistor 2012(0805)]  (value not drawn)
R_DDR_ODTCA  Resistor  [Resistor 2012(0805)]  (value not drawn)
R_DDR_RESET  Resistor  [Resistor 2012(0805)]  (value not drawn)
R_DDR_ZQ  Resistor  [Resistor 2012(0805)]  (value not drawn)
R_PMIC_SDPullup  Resistor  [Resistor 2012(0805)]  (value not drawn)
R_VCC_LED  Resistor  [Resistor 2012(0805)]  (value not drawn)
R_VMON_1  Resistor  [Resistor 2012(0805)]  (value not drawn)
R_VMON_2  Resistor  [Resistor 2012(0805)]  (value not drawn)
Switch3.3V  Switch TPS22959DNYR  [Switch TPS22959DNYR]  (value not drawn)
X  Crystal 4pin  [Crystal 2.5x2mm]  (value not drawn)